# Altium project RPIShield_Rev1.PrjPcb
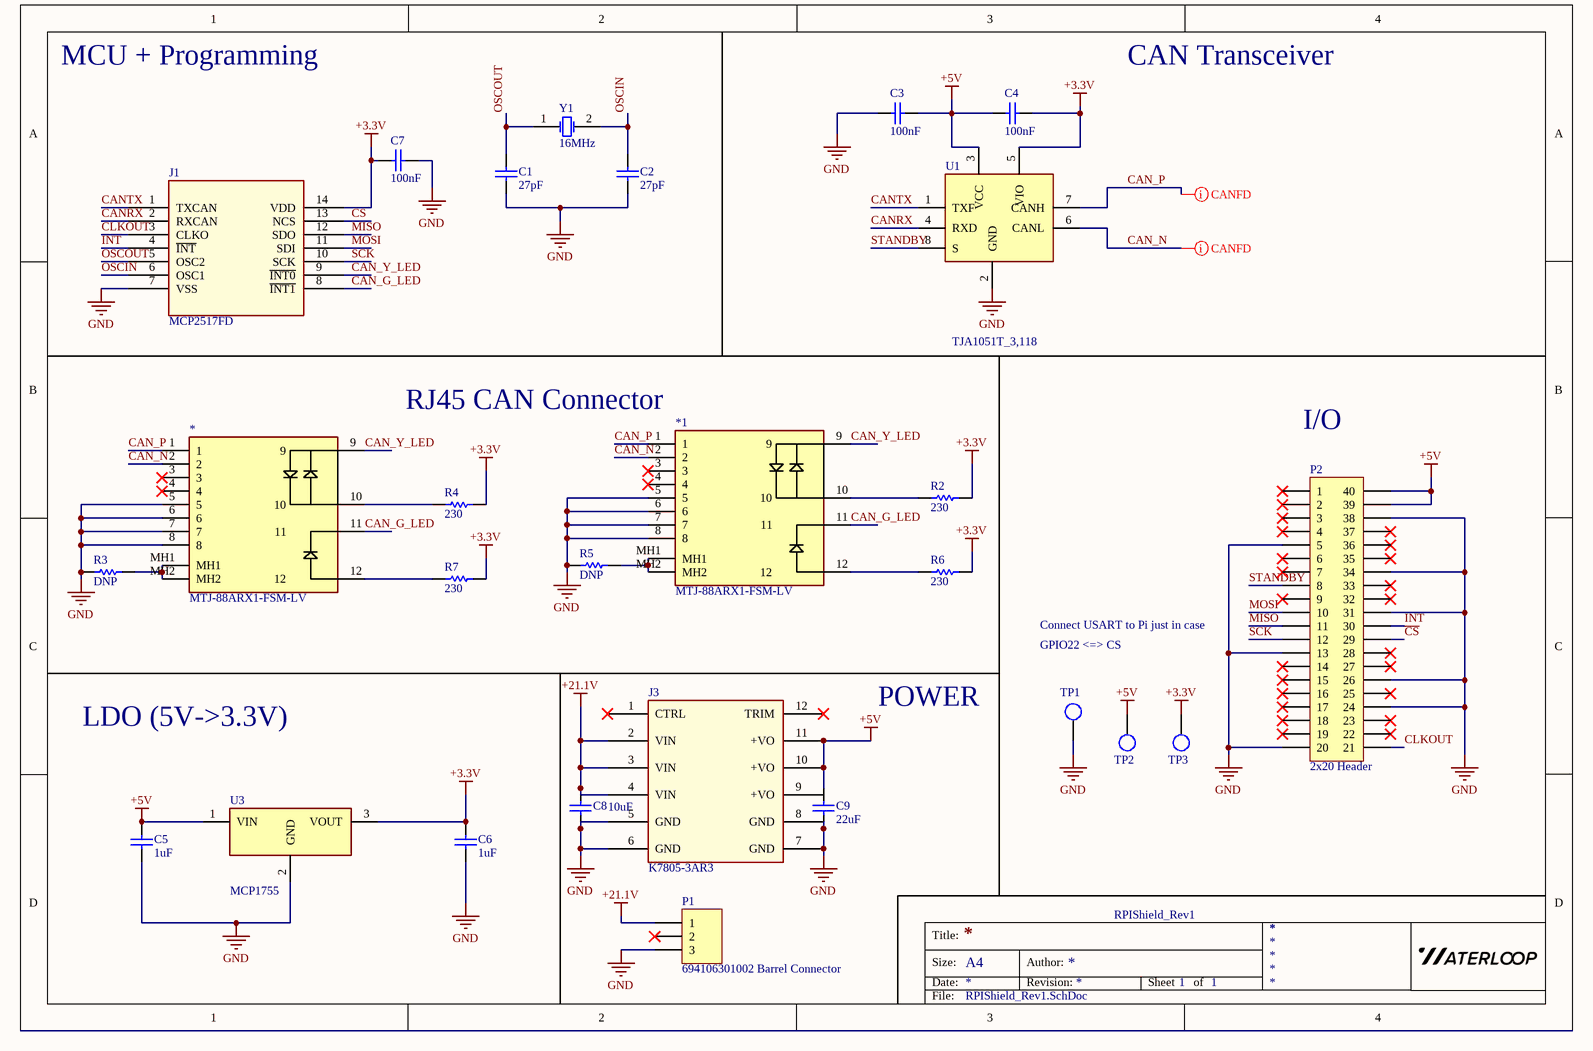
[diagram p0: RPIShield_Rev1.SchDoc]
1 sheet, 27 parts. Net scope: global (net labels, ports and power ports of the same name join across sheets).
Board file: RPIShield_Rev1.PcbDoc

## Sheet RPIShield_Rev1.SchDoc
size A4; SheetNumber: 1; SheetTotal: 1

### Parts
*1  MTJ-88ARX1-FSM-LV  [MTJ-88ARX1-FSM-LV]
C1  value 27pF  [0805 - Capacitor]  (hidden comment: Capacitor - Nonpolarized)
C2  value 27pF  [0805 - Capacitor]  (hidden comment: Capacitor - Nonpolarized)
C3  value 100nF  [0805 - Capacitor]  (hidden comment: Capacitor - Nonpolarized)
C4  value 100nF  [0805 - Capacitor]  (hidden comment: Capacitor - Nonpolarized)
C5  value 1uF  [0805 - Capacitor]  (hidden comment: Capacitor - Nonpolarized)
C6  value 1uF  [0805 - Capacitor]  (hidden comment: Capacitor - Nonpolarized)
C7  value 100nF  [0805 - Capacitor]  (hidden comment: Capacitor - Nonpolarized)
C8  value 10uF  [0805 - Capacitor]  (hidden comment: Capacitor - Nonpolarized)
C9  value 22uF  [0805 - Capacitor]  (hidden comment: Capacitor - Nonpolarized)
CAN_OUT  MTJ-88ARX1-FSM-LV  [MTJ-88ARX1-FSM-LV]
J1  MCP2517FD  [MCP2517FD]
J3  K7805-3AR3  [K7805-3AR3]
P1  694106301002 Barrel Connector  [694106301002]
P2  2x20 Header  [HDR2X20]
R2  value 230  [0603 - Resistor]  (hidden comment: Resistor)
R3  value DNP  [0603 - Resistor]  (hidden comment: Resistor)
R4  value 230  [0603 - Resistor]  (hidden comment: Resistor)
R5  value DNP  [0603 - Resistor]  (hidden comment: Resistor)
R6  value 230  [0603 - Resistor]  (hidden comment: Resistor)
R7  value 230  [0603 - Resistor]  (hidden comment: Resistor)
TP1  Test Point  [Test Point - 5002]  (value not drawn)  (no BOM)
TP2  Test Point  [Test Point - 5002]  (value not drawn)  (no BOM)
TP3  Test Point  [Test Point - 5002]  (value not drawn)  (no BOM)
U1  TJA1051T_3,118  [TJA1051T/3,118 - duplicate]
U3  MCP1755  [MCP1755ST]
Y1  value 16MHz  [2-SMD NO LEAD CRSYSTAL]  (hidden comment: Oscillator)

### Nets
+3.3V: C4.2 C6.2 C7.2 J1.14(VDD) R2.2 R4.2 R6.2 R7.2 TP3.1 U1.5(VIO) U3.3(VOUT)
+5V: C3.2 C4.1 C5.1 C9.2 J3.10(+VO) J3.11(+VO) P2.39 P2.40 TP2.1 U1.3(VCC) U3.1(VIN)
+21.1V: C8.1 J3.2(VIN) J3.3(VIN) J3.4(VIN) P1.1
GND: *1.5 *1.6 *1.7 *1.8 C1.1 C2.1 C3.1 C5.2 C6.1 C7.1 C8.2 C9.1 CAN_OUT.5 CAN_OUT.6 CAN_OUT.7 CAN_OUT.8 J1.7(VSS) J3.5(GND) J3.6(GND) J3.7(GND) J3.8(GND) P1.3 P2.5 P2.13 P2.20 P2.24 P2.26 P2.31 P2.34 P2.38 R3.1 R5.1 TP1.1 U1.2(GND) U3.2(GND)
~{INT}: J1.4(~{INT}) P2.30
~{CS}: J1.13(NCS) P2.29
CAN_G_LED: *1.11 CAN_OUT.11 J1.8(~{INT1})
CAN_N: *1.2 CAN_OUT.2 U1.6(CANL)
CAN_P: *1.1 CAN_OUT.1 U1.7(CANH)
CAN_Y_LED: *1.9 CAN_OUT.9 J1.9(~{INT0})
CANRX: J1.2(RXCAN) U1.4(RXD)
CANTX: J1.1(TXCAN) U1.1(TXF)
CLKOUT: J1.3(CLKO) P2.21
MISO: J1.12(SDO) P2.11
MOSI: J1.11(SDI) P2.10
OSCIN: C2.2 J1.6(OSC1) Y1.2(OSC2)
OSCOUT: C1.2 J1.5(OSC2) Y1.1(OSC1)
SCK: J1.10(SCK) P2.12
STANDBY: P2.8 U1.8(S)
Net*1_10: *1.10 R2.1
Net*1_12: *1.12 R6.1
Net*1_MH1: *1.MH1 *1.MH2 R5.2
NetCAN_OUT_10: CAN_OUT.10 R4.1
NetCAN_OUT_12: CAN_OUT.12 R7.1
NetCAN_OUT_MH1: CAN_OUT.MH1 CAN_OUT.MH2 R3.2

Not connected (* = marked no-connect by the designer): *1 3* 4*; CAN_OUT 3* 4*; J3 1(CTRL)* 9(+VO) 12(TRIM)*; P1 2*; P2 1* 2* 3* 4* 6* 7* 9* 14* 15* 16* 17* 18* 19* 22* 23* 25* 27* 28* 32* 33* 35* 36* 37*

### Layout directives
differential pair: CAN_N, CAN_P

### Notes on the sheet
- MCU + Programming
- CAN Transceiver
- (near *1) RJ45 CAN Connector
- I/O
- Connect USART to Pi just in case
- GPIO22 <=> CS
- POWER
- LDO (5V->3.3V)
- RPIShield_Rev1
- Title:
- Size:
- Date:
- A4
- Author:
- Revision:
- Sheet
- of
- File:

### Library data of the parts
*1 CAN_OUT = MTJ-88ARX1-FSM-LV: RJ45 Connector
C1 C2 = Capacitor - Nonpolarized: Nonpolarized Capacitor; Manufacturer: Yageo; Manufacturer Part Number: CC0805JRNPO9BN270; Supplier Part Number: 311-1104-1-ND; Supplier: Digikey; Rating: *
C3 C4 C7 = Capacitor - Nonpolarized: Nonpolarized Capacitor; Manufacturer: Yageo; Manufacturer Part Number: CC0805KRX7R8BB104; Supplier Part Number: 311-1141-1-ND; Supplier: Digikey; Rating: *
C5 C6 C8 C9 = Capacitor - Nonpolarized: Nonpolarized Capacitor; Manufacturer: Yageo; Manufacturer Part Number: CC0805KFX7R6BB106; Supplier Part Number: 13-CC0805KFX7R6BB106CT-ND; Supplier: Digikey; Rating: *
J1 = MCP2517FD: CANbus Controller CAN 2.0 SPI Interface 14-SOIC; Manufacturer Name: Microchip Technology; Manufacturer Part Number: MCP2517FDT-H/SL; Supplier: Digikey; Supplier Part Number: MCP2517FDT-H/SLTR-ND; Datasheet: https://ww1.microchip.com/downloads/en/DeviceDoc/MCP2517FD-External-CAN-FD-Controller-with-SPI-Interface-20005688B.pdf
J3 = K7805-3AR3: Non-Isolated PoL Module DC DC Converter 1 Output 5V 3A 8V - 36V Input; Manufacturer Name: Mornsun America, LLC; Manufacturer Part Number: K7805-3AR3; Supplier: Digikey; Supplier Part Number: 2725-K7805-3AR3-ND; Datasheet: https://www.mornsun-power.com/html/pdf/K7803-3AR3.html
P1 = 694106301002 Barrel Connector: CONN PWR JACK 2.1X5.5MM SOLDER; Manufacturer: Würth Elektronik; Manufacturer Part Number: 694106301002; Supplier: Digikey; Supplier Part Number: 732-5930-ND; Datasheet: https://www.we-online.com/katalog/datasheet/6941xx301002.pdf
P2 = 2x20 Header: 2x20 Pin Header
R2-R7 = Resistor: Manufacturer Part Number: RC0603FR-0710KL; Manufacturer: Yageo; Rating: *; Supplier Part Number: 311-10.0KHRCT-ND; Supplier: Digikey
U1 = TJA1051T_3,118: CAN Transceiver IC 4.5V-5.5V 250ns; Manufacturer: NXP; Manufacturer Part Number: TJA1051T/3,118; Supplier Part Number: 568-8684-1-ND; Supplier: Digikey; ComponentLink1Description: Datasheet; ComponentLink1URL: http://www.nxp.com/docs/en/data-sheet/TJA1051.pdf
U3 = MCP1755ST: Linear Regulator 300mA; Manufacturer: Microchip; Manufacturer Part Number: *; Supplier: Digikey; Supplier Part Number: *; ComponentLink1Description: Datasheet; ComponentLink1URL: http://ww1.microchip.com/downloads/en/devicedoc/25160a.pdf
Y1 = Oscillator: Crystal Oscillator; Manufacturer Part Number: ABM7-16.000MHZ-4-T; Manufacturer: Abracon LLC; Supplier Part Number: 535-13460-1-ND; Supplier: Digikey; Rating: *